# Altium schematic sheet Peripherals.SchDoc
size A
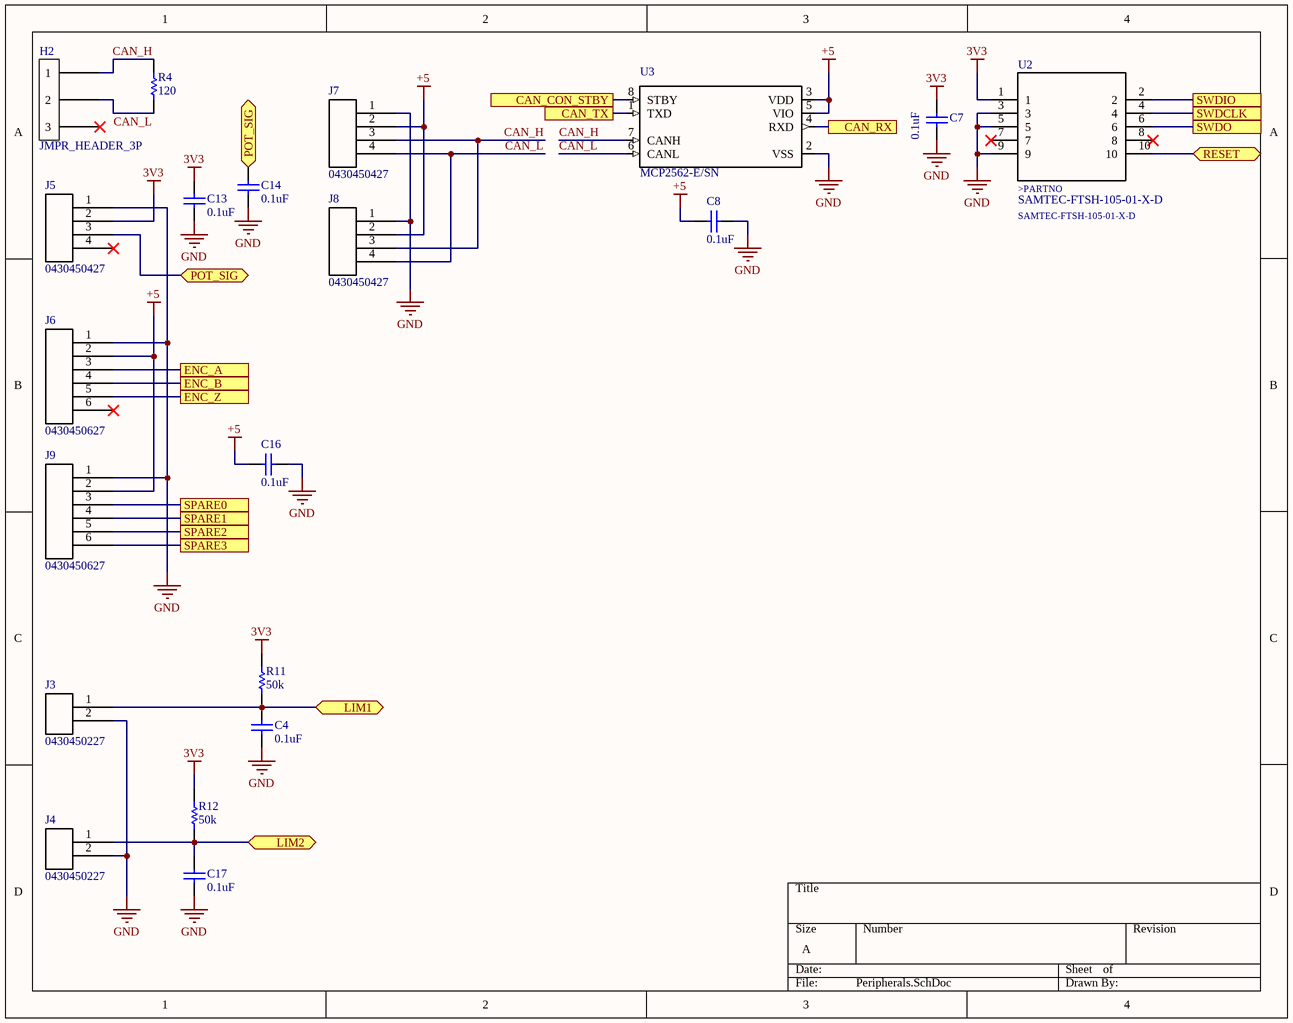
[diagram p0: Peripherals.SchDoc]

## Parts
C4  value 0.1uF  [RESC2013X60X35LL10T20]  (hidden comment: Cap Semi)
C7  value 0.1uF  [RESC2013X60X35LL10T20]  (hidden comment: Cap Semi)
C8  value 0.1uF  [RESC2013X60X35LL10T20]  (hidden comment: Cap Semi)
C13  value 0.1uF  [RESC2013X60X35LL10T20]  (hidden comment: Cap Semi)
C14  value 0.1uF  [RESC2013X60X35LL10T20]  (hidden comment: Cap Semi)
C16  value 0.1uF  [RESC2013X60X35LL10T20]  (hidden comment: Cap Semi)
C17  value 0.1uF  [RESC2013X60X35LL10T20]  (hidden comment: Cap Semi)
H2  JMPR_HEADER_3P  [STD3P]
J3  0430450227  [0430450227]
J4  0430450227  [0430450227]
J5  0430450427  [0430450427]
J6  0430450627  [0430450627]
J7  0430450427  [0430450427]
J8  0430450427  [0430450427]
J9  0430450627  [0430450627]
R4  120  [RESC2013X60X35LL10T20]
R11  50k  [RESC2013X60X35LL10T20]
R12  50k  [RESC2013X60X35LL10T20]
U2  SAMTEC-FTSH-105-01-X-D  [SAMTEC-FTSH-105-01-X-D]
U3  MCP2562-E/SN  [SOIC127P600X175-8N]

## Ports
CAN_CON_STBY, CAN_RX, CAN_TX, ENC_A, ENC_B, ENC_Z, LIM1 (bidir), LIM2 (bidir), POT_SIG (bidir), RESET (bidir), SPARE0, SPARE1, SPARE2, SPARE3, SWDCLK, SWDIO, SWDO

## Nets
3V3: C7.2 C13.1 J5.2 R11.1 R12.1 U2.1
+5: C8.2 C16.2 J6.2 J7.2 J8.2 J9.2 U3.3(VDD) U3.5(VIO)
GND: C4.2 C7.1 C8.1 C13.2 C14.2 C16.1 C17.2 J3.2 J4.2 J5.1 J6.1 J7.1 J8.1 J9.1 U2.3 U2.5 U2.9 U3.2(VSS)
CAN_CON_STBY: U3.8(STBY) ; port CAN_CON_STBY
CAN_H: H2.1 J7.3 J8.3 R4.1 U3.7(CANH)
CAN_L: H2.2 J7.4 J8.4 R4.2 U3.6(CANL)
CAN_RX: U3.4(RXD) ; port CAN_RX
CAN_TX: U3.1(TXD) ; port CAN_TX
ENC_A: J6.3 ; port ENC_A
ENC_B: J6.4 ; port ENC_B
ENC_Z: J6.5 ; port ENC_Z
LIM1: C4.1 J3.1 R11.2 ; port LIM1
LIM2: C17.1 J4.1 R12.2 ; port LIM2
POT_SIG: C14.1 J5.3 ; port POT_SIG
RESET: U2.10 ; port RESET
SPARE0: J9.3 ; port SPARE0
SPARE1: J9.4 ; port SPARE1
SPARE2: J9.5 ; port SPARE2
SPARE3: J9.6 ; port SPARE3
SWDCLK: U2.4 ; port SWDCLK
SWDIO: U2.2 ; port SWDIO
SWDO: U2.6 ; port SWDO

Not connected (* = marked no-connect by the designer): H2 3*; J5 4*; J6 6*; U2 7* 8*

## Notes on the sheet
- (in symbol SAMTEC-FTSH-105-01-X-D) >PARTNO

## Library data of the parts
C4 C7 C8 C13 C14 C16 C17 = Cap Semi: Capacitor (Semiconductor SIM Model); Published: 8-Jun-2000; LatestRevisionDate: 29-May-2009; LatestRevisionNote: IPC-7351 Footprint Added.; PackageReference: C1206; Publisher: Altium Limited; PackageDescription: Chip Capacitor
J3 J4 = 0430450227-Single row schematic: Micro-fit 3.0 connector. P/N 0430450227
J5 J7 J8 = 0430450427-Single row schematic: Molex micro-fit 3.0 dual row header. P/N 0430450427
J6 J9 = 0430450627-Single row schematic: Molex micro-fit 3.0 dual row connector. P/N 0430450627
R4 R11 R12 = RES-2
U2 = SAMTEC-FTSH-105-01-X-D: Conn Unshrouded Header HDR 10 POS 1.27mm Solder ST Thru-Hole Automotive Tube; MP: FTSH-105-01-F-D-K; MF: Samtec Inc.; SnapEDA_Link: https://www.snapeda.com/parts/FTSH-105-01-F-D-K/Samtec%20Inc./view-part/?ref=snap; Digi-Key_Part_Number: SAM8909-ND; Digi-Key_Purchase_URL: https://www.digikey.com/product-detail/en/samtec-inc/FTSH-105-01-F-D-K/SAM8909-ND/1850757?utm_source=snapeda&utm_medium=aggregator&utm_campaign=symbol; Package: None; Value: *
U3 = MCP2562-E/SN: Microchip MCP2562-E/SN, CAN Transceiver 1MBps 1-channel IEC 61000-4-2, 8-Pin SOIC; Price: None; MF: Microchip; SnapEDA_Link: https://www.snapeda.com/parts/MCP2562-E/SN/Microchip/view-part/?ref=snap; MP: MCP2562-E/SN; Availability: Unavailable; Package: SO-8 Microchip; Value: *